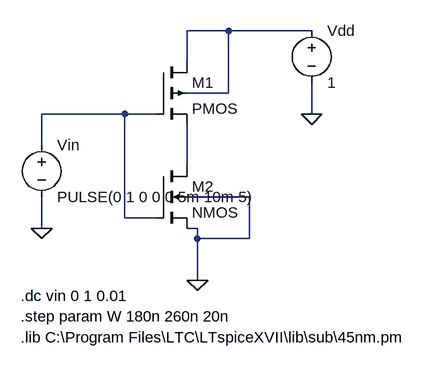
[diagram p0: schematic CMOS inv.asc]
CMOS inv.asc, the LTspice schematic file:
Version 4
SHEET 1 880 680
WIRE 208 -32 144 -32
WIRE 336 -32 208 -32
WIRE 144 16 144 -32
WIRE 208 64 208 -32
WIRE 208 64 144 64
WIRE 48 96 -80 96
WIRE 96 96 48 96
WIRE 336 96 336 48
WIRE -80 144 -80 96
WIRE 144 176 144 112
WIRE 240 224 144 224
WIRE 48 256 48 96
WIRE 96 256 48 256
WIRE -80 272 -80 224
WIRE 160 272 144 272
WIRE 160 288 160 272
WIRE 240 288 240 224
WIRE 240 288 160 288
WIRE 160 352 160 288
FLAG 336 96 0
FLAG -80 272 0
FLAG 160 352 0
SYMBOL voltage 336 -48 R0
WINDOW 123 0 0 Left 0
WINDOW 39 0 0 Left 0
SYMATTR InstName Vdd
SYMATTR Value 1
SYMBOL voltage -80 128 R0
WINDOW 123 0 0 Left 0
WINDOW 39 0 0 Left 0
SYMATTR InstName Vin
SYMATTR Value PULSE(0 1 0 0 0 5m 10m 5)
SYMBOL pmos4 96 16 R0
SYMATTR InstName M1
SYMATTR Value2 l=45nm
SYMBOL nmos4 96 176 R0
SYMATTR InstName M2
SYMATTR Value2 l=45nm w=90nm
TEXT -112 376 Left 2 !.dc vin 0 1 0.01
TEXT -112 408 Left 2 !.step param W 180n 260n 20n
TEXT -112 440 Left 2 !.lib C:\\Program Files\\LTC\\LTspiceXVII\\lib\\sub\\45nm.pm

The netlist it stands for:
* CMOS inv.asc
Vdd N001 0 1
Vin N002 0 PULSE(0 1 0 0 0 5m 10m 5)
M1 N001 N002 N003 N001 PMOS l=45nm
M2 N003 N002 0 0 NMOS l=45nm w=90nm
.model NMOS NMOS
.model PMOS PMOS
.lib standard.mos
.dc vin 0 1 0.01
.step param W 180n 260n 20n
.lib C:\Program Files\LTC\LTspiceXVII\lib\sub\45nm.pm
.backanno
.end